# Altium project 7907.PrjPcb
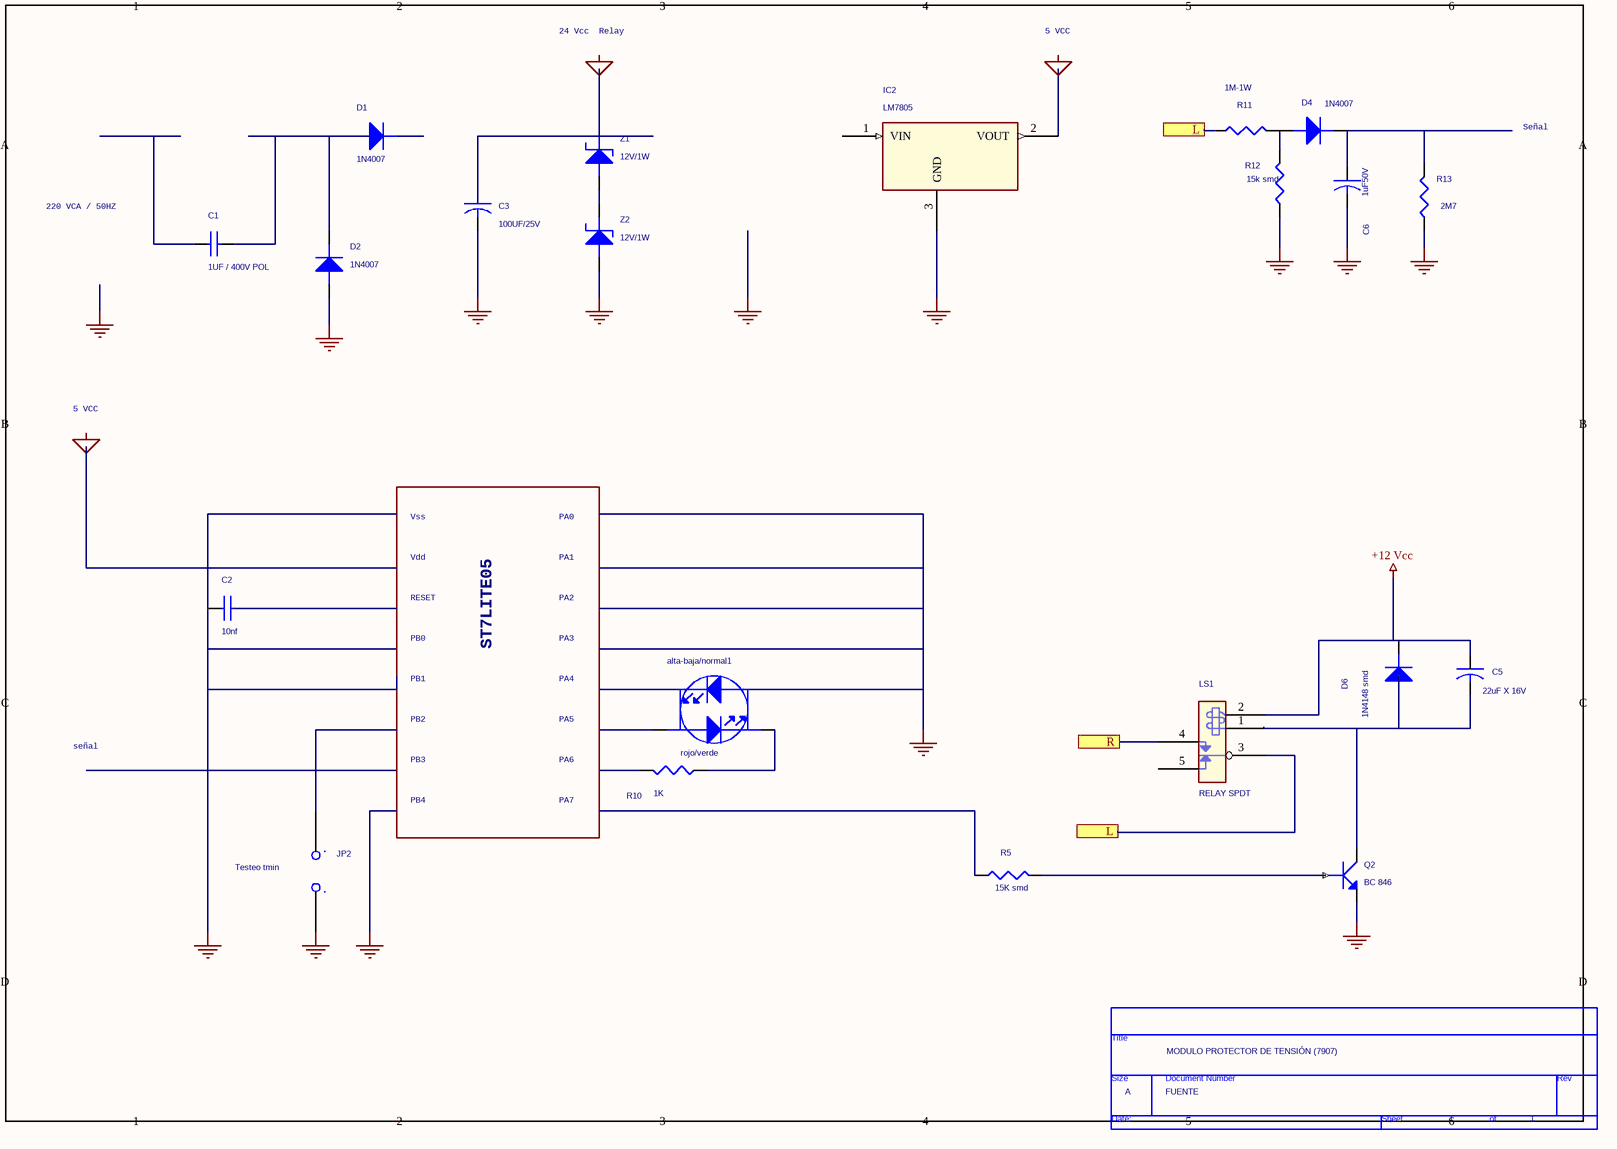
[diagram p0: PAGE1.SchDoc]
1 sheet, 22 parts. Net scope: flat (ports and power ports of the same name join across sheets).

## Sheet PAGE1.SchDoc
size 297 x 209 mm

### Parts
*  Page Count: 1  Page Size: A  Title: MODULO PROTECTOR DE TENSIÓN (7907)  Doc: FUENTE  (hidden comment: TitleBlock0)  (graphical)
alta-baja/normal1  rojo/verde
C1  1UF / 400V POL
C2  10nf
C3  100UF/25V
C5  22uF X 16V
C6  1uF50V
D1  1N4007
D2  1N4007
D4  1N4007
D6  1N4148 smd
IC2  LM7805
JP2  Testeo tmin
LS1  RELAY SPDT
Q2  BC 846
R5  15K smd
R10  1K
R11  1M-1W
R12  15k smd
R13  2M7
Z1  12V/1W
Z2  12V/1W

### Ports
L, R

### Nets
+12 Vcc: C5.1 D6.CATHODE LS1.2(COIL2)
GND POWER: C2.1 C3.2 C6.2 D2.ANODE IC2.3(GND) JP2.2 Q2.EMITTER R12.1 R13.1 Z2.ANODE
Netalta-baja/normal1_CATHODE: alta-baja/normal1.CATHODE R10.1
NetC1_2: C1.2 D1.ANODE D2.CATHODE
NetC3_1: C3.1 Z1.CATHODE
NetC5_2: C5.2 D6.ANODE LS1.1(COIL1) Q2.COLLECTOR
NetD4_ANODE: D4.ANODE R11.2 R12.2
NetD4_CATHODE: D4.CATHODE R13.2
NetLS1_3: LS1.3(COMMON) R11.1 ; port L
NetLS1_4: LS1.4(NO) ; port R
NetQ2_BASE: Q2.BASE R5.2
NetZ1_ANODE: Z1.ANODE Z2.CATHODE

Not connected (* = marked no-connect by the designer): alta-baja/normal1 ANODE; C1 1; C2 2; C6 1; D1 CATHODE; IC2 1(VIN) 2(VOUT); JP2 1; LS1 5(NC); R5 1; R10 2

### Notes on the sheet
- 24 Vcc  Relay
- 5 VCC
- Señal
- 220 VCA / 50HZ
- Vss
- PA0
- Vdd
- RESET
- PA2
- PA1
- PB0
- ST7LITE05
- PA3
- PB1
- PB2
- PA5
- PA4
- señal
- PB3
- PB4
- PA7
- PA6
- Labels drawn without touching a wire or pin: 24 Vcc ( al relay), GND SIGNAL
- (in symbol TitleBlock0) Title; Size; Document Number; Rev; Date:; Sheet; of

### Library data of the parts
alta-baja/normal1 = LED_0
C1 C2 = CAP NP
C3 C6 = CAP_Dup1
C5 = CAP
D1 D2 D4 = DIODE_Dup1
D6 = DIODE
JP2 = SW PUSHBUTTON_1
Q2 = NPN
R5 = R
R10-R13 = R_Dup1
Z1 Z2 = DIODE ZENER
* = TitleBlock0: Page Number: 1; Page Create Date: March  8, 1995